# Altium schematic sheet main.SchDoc: Amplificador PH
size A4; CompanyName: Sento S.A.S; Engineer: Jose Pavas; SheetNumber: 1; SheetTotal: 4
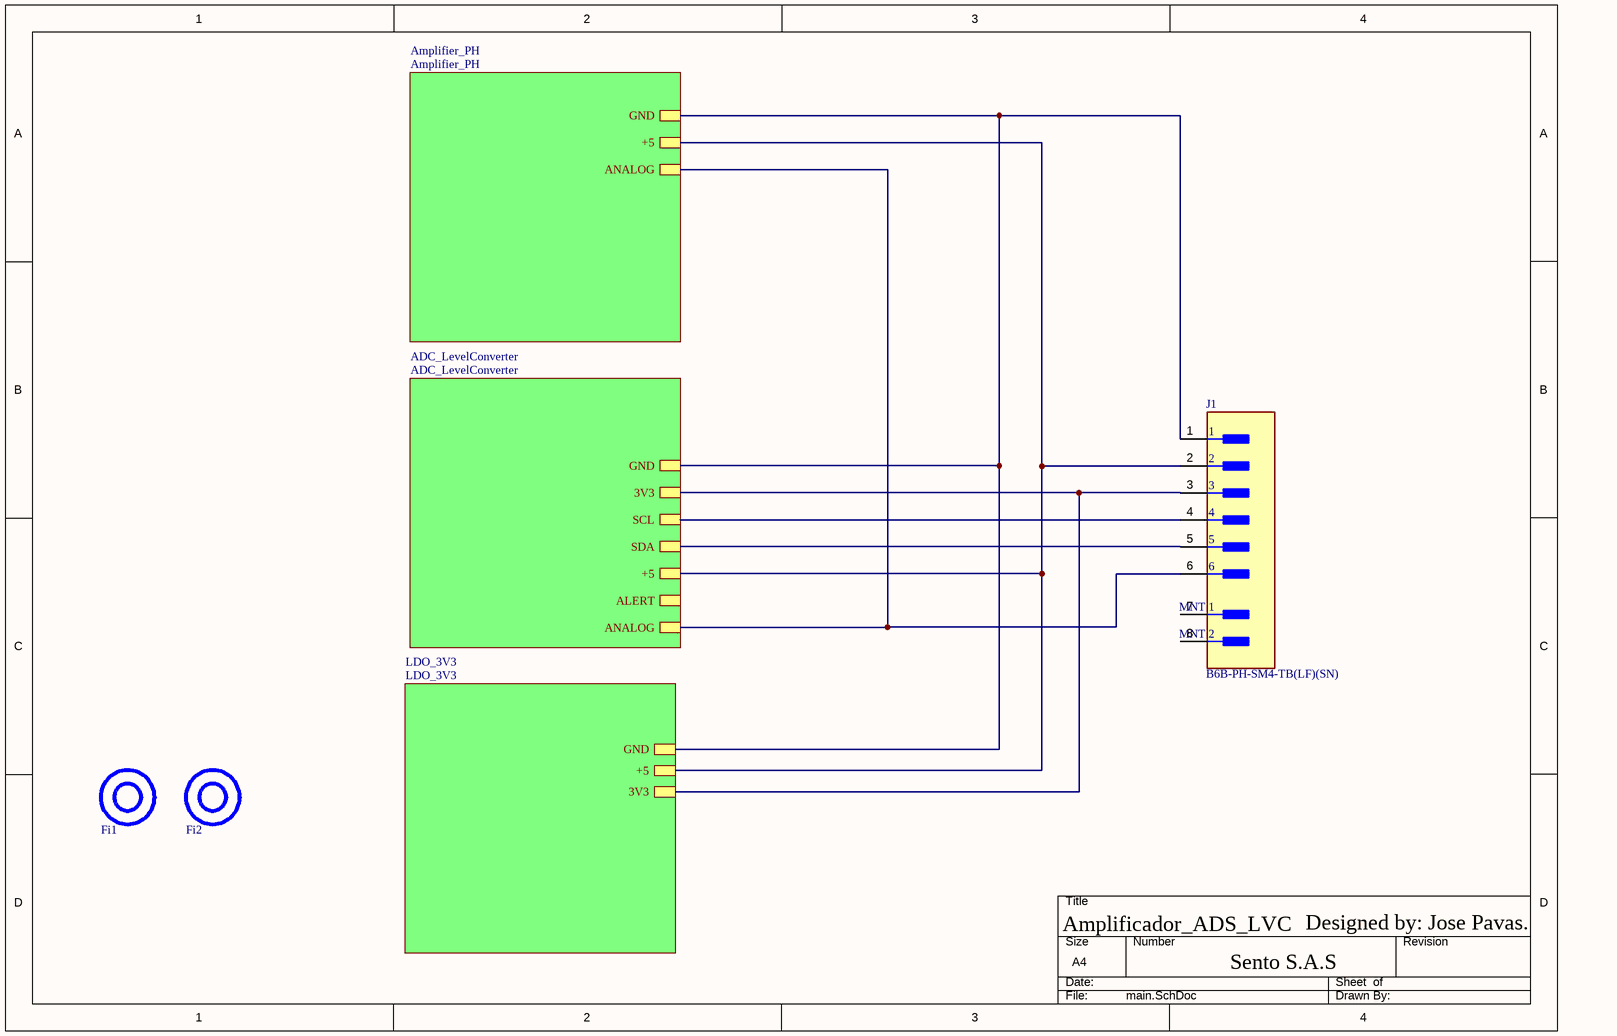
[diagram p0: main.SchDoc]

## Parts
Fi1  HOLE  [FIDUCIAL_TEST_PCB_2C]  (value not drawn)  (no BOM)
Fi2  HOLE  [FIDUCIAL_TEST_PCB_2C]  (value not drawn)  (no BOM)
J1  B6B-PH-SM4-TB(LF)(SN)  [FP-B6B-PH-SM4-TB_LF_SN-MFG]

## Sub-sheets
ADC_LevelConverter = ADC_LevelConverter: ANALOG, SDA, GND, SCL, +5, ALERT, 3V3
Amplifier_PH = Amplifier_PH: GND, +5, ANALOG
LDO_3V3 = LDO_3V3: GND, +5, 3V3

## Nets
NetJ1_1: J1.1 ; sheet ADC_LevelConverter/GND, sheet Amplifier_PH/GND, sheet LDO_3V3/GND
NetJ1_2: J1.2 ; sheet ADC_LevelConverter/+5, sheet Amplifier_PH/+5, sheet LDO_3V3/+5
NetJ1_3: J1.3 ; sheet ADC_LevelConverter/3V3, sheet LDO_3V3/3V3
NetJ1_4: J1.4 ; sheet ADC_LevelConverter/SCL
NetJ1_5: J1.5 ; sheet ADC_LevelConverter/SDA
NetJ1_6: J1.6 ; sheet ADC_LevelConverter/ANALOG, sheet Amplifier_PH/ANALOG

Not connected (* = marked no-connect by the designer): J1 7(MNT_1) 8(MNT_2)

## Notes on the sheet
- Amplificador_ADS_LVC
- Sento S.A.S
- Designed by: Jose Pavas.
- DWG NO:
- REV:
- THIS DOCUMENT AND THE DATA DISCLOSED HEREIN OR
- HEREWITH IS THE PROPERTY OF ALTIUM LIMITED AND MAY
- BE FREELY DISTRIBUTED IN WHOLE. NO RIGHTS ARE
- RESERVED OR EXPRESS OR IMPLIED WARANTEE GIVEN.
- REVISION
- DESCRIPTION
- DATE
- APPROVED
- ENG:
- APPROVALS
- PROJECT
- DSN:
- CHK:
- REFERENCE DOCUMENTS
- PROJECT REVISION:
- TITLE
- DOCUMENT REVISION:
- DESIGN ITEM:
- BOM:
- FAB DWG:
- PCB DWG:
- ASSY DWG:
- SCALE:
- A2
- SIZE
- CAGE CODE
- FILE NAME
- DWG NO.
- SHEET
- OF
- REV

## Library data of the parts
Fi1 Fi2 = MH_d3mm: hole diamenter 4.2 mm
J1 = CMP-17439-000051-1: CONN HEADER SMD 6POS 2MM; Number of Positions: 6; Working Voltage: 100V; Contact Resistance: 10mR; Insulation Resistance: 1GR; Current Rating: 2A; Mated Stacking Heights: 8.6mm; Gender: Male; Max Operating Temperature: 85°C; Contact Finish - Mating: TIN; Min Operating Temperature: -25°C; Height: 9.4mm; Contact Plating: Tin; Number of Poles: 6; Series: PH; Number of Rows: 1; Termination: Solder; Packaging: Tape and Reel; Contact Mating Length: 0.13inch; Voltage Rating (AC): 100V; Insulation Height: 0.26inch; Mount: Surface Mount; Contact Material: Copper Alloy; Length: 13.9mm; Contact Shape: Square; Flammability Rating: UL94 V-0; Voltage Rating: 100V; Contact Type: Male Pin; Connector Type: Header; Lead Pitch: 2mm; Housing Color: Natural; Color: Natural; Insulation Material: Nylon; Insulation Color: Natural; REACH SVHC: No SVHC; Housing Material: Nylon; Pitch: 2mm; Fastening Type: Detent; Orientation: Straight; Lead Free: Lead Free; Width: 5.5mm; Number of Contacts: 6